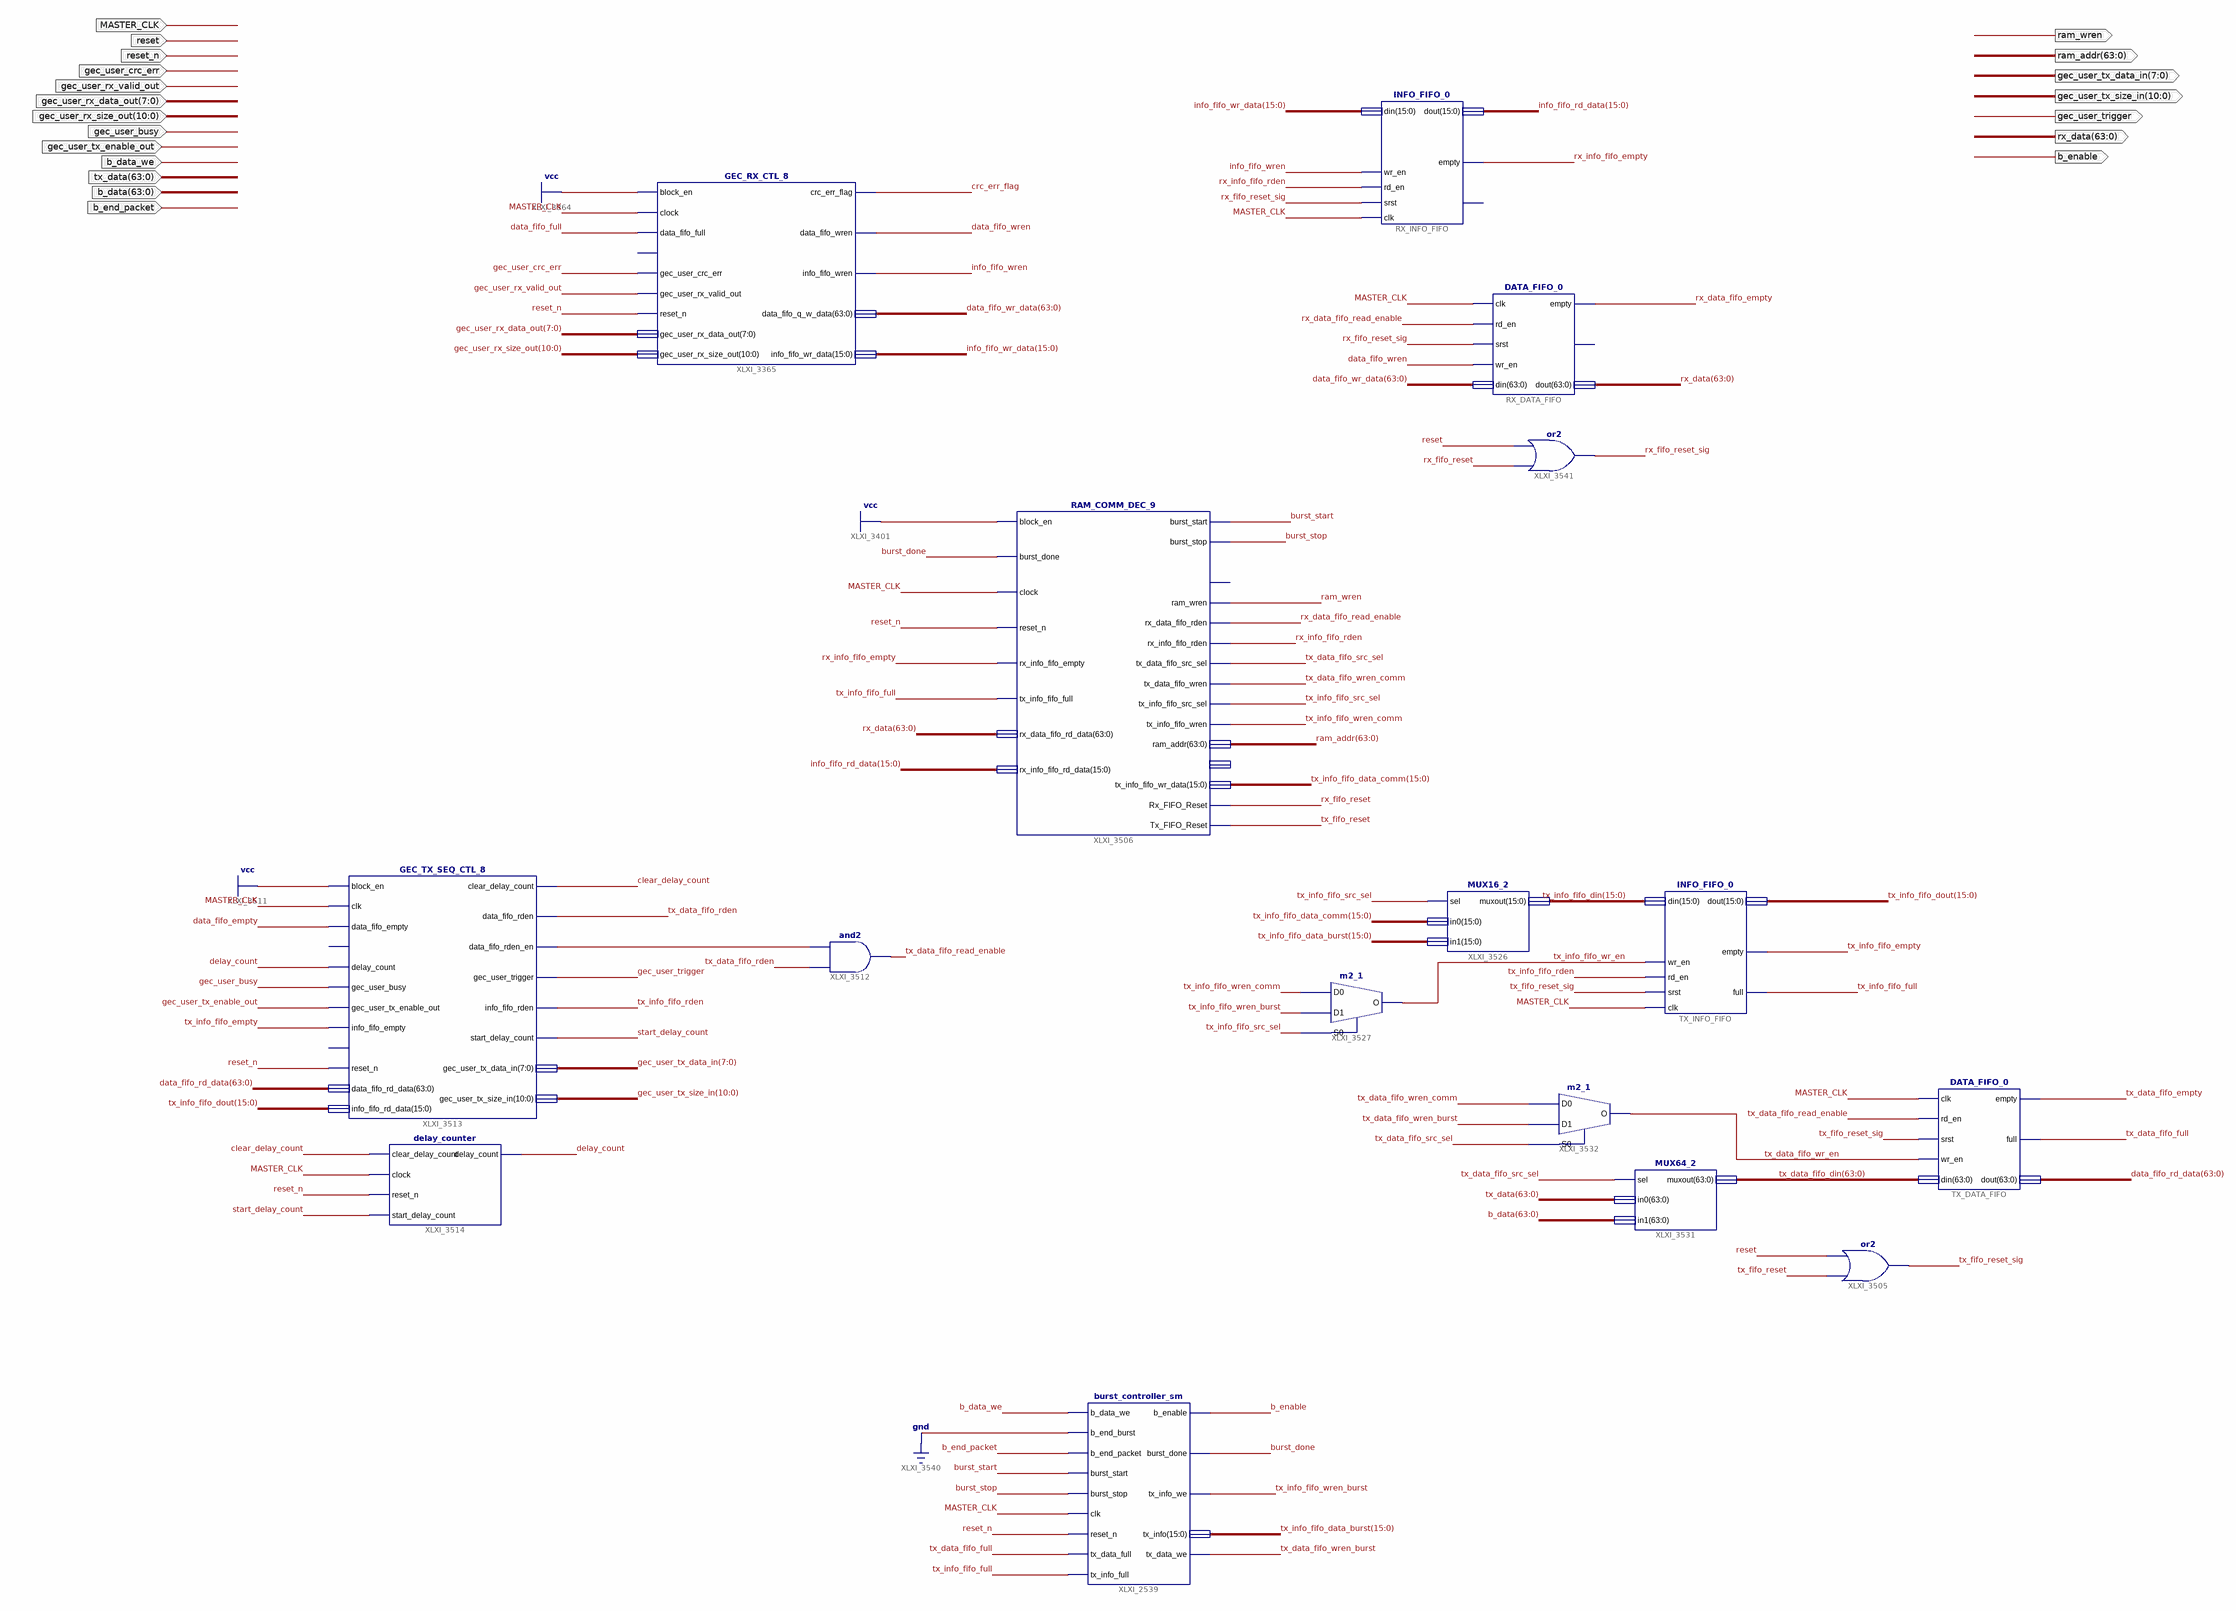
[diagram p0: schematic sheet 1]
// Xilinx ISE schematic DATA_MANAGER.sch (virtex4) as structural Verilog: 16 symbols, 20 ports
module DATA_MANAGER (
  input  reset,
  input  MASTER_CLK,
  input  reset_n,
  input  [10:0] gec_user_rx_size_out,
  input  gec_user_crc_err,
  input  gec_user_rx_valid_out,
  input  [7:0] gec_user_rx_data_out,
  input  gec_user_busy,
  input  gec_user_tx_enable_out,
  input  b_data_we,
  input  [63:0] tx_data,
  input  [63:0] b_data,
  input  b_end_packet,
  output [63:0] rx_data,
  output ram_wren,
  output [63:0] ram_addr,
  output [7:0] gec_user_tx_data_in,
  output [10:0] gec_user_tx_size_in,
  output gec_user_trigger,
  output b_enable
);

  wire burst_done, burst_start, burst_stop, clear_delay_count, crc_err_flag, data_fifo_empty, data_fifo_full,
       data_fifo_rden_en, data_fifo_wren, delay_count, info_fifo_wren, rx_data_fifo_empty,
       rx_data_fifo_read_enable, rx_fifo_reset, rx_fifo_reset_sig, rx_info_fifo_empty, rx_info_fifo_rden,
       start_delay_count, tx_data_fifo_empty, tx_data_fifo_full, tx_data_fifo_rden, tx_data_fifo_read_enable,
       tx_data_fifo_src_sel, tx_data_fifo_wr_en, tx_data_fifo_wren_burst, tx_data_fifo_wren_comm,
       tx_fifo_reset, tx_fifo_reset_sig, tx_info_fifo_empty, tx_info_fifo_full, tx_info_fifo_rden,
       tx_info_fifo_src_sel, tx_info_fifo_wr_en, tx_info_fifo_wren_burst, tx_info_fifo_wren_comm;
  wire [15:0] info_fifo_rd_data, info_fifo_wr_data, tx_info_fifo_data_burst, tx_info_fifo_data_comm,
       tx_info_fifo_din, tx_info_fifo_dout;
  wire [63:0] data_fifo_rd_data, data_fifo_wr_data, tx_data_fifo_din;

  GEC_TX_SEQ_CTL_8 XLXI_3513 (
    .block_en(1'b1), .clk(MASTER_CLK), .data_fifo_empty(data_fifo_empty), .delay_count(delay_count),
    .gec_user_busy(gec_user_busy), .gec_user_tx_enable_out(gec_user_tx_enable_out),
    .info_fifo_empty(tx_info_fifo_empty), .reset_n(reset_n), .data_fifo_rd_data(data_fifo_rd_data),
    .info_fifo_rd_data(tx_info_fifo_dout), .clear_delay_count(clear_delay_count),
    .data_fifo_rden(tx_data_fifo_rden), .data_fifo_rden_en(data_fifo_rden_en),
    .gec_user_trigger(gec_user_trigger), .info_fifo_rden(tx_info_fifo_rden),
    .start_delay_count(start_delay_count), .gec_user_tx_data_in(gec_user_tx_data_in),
    .gec_user_tx_size_in(gec_user_tx_size_in));  // open: data_fifo_rderr, info_fifo_rderr
  delay_counter XLXI_3514 (
    .clear_delay_count(clear_delay_count), .clock(MASTER_CLK), .reset_n(reset_n),
    .start_delay_count(start_delay_count), .delay_count(delay_count));
  and XLXI_3512 (tx_data_fifo_read_enable, tx_data_fifo_rden, data_fifo_rden_en);
  INFO_FIFO_0 TX_INFO_FIFO (
    .wr_en(tx_info_fifo_wr_en), .clk(MASTER_CLK), .srst(tx_fifo_reset_sig), .din(tx_info_fifo_din),
    .rd_en(tx_info_fifo_rden), .dout(tx_info_fifo_dout), .empty(tx_info_fifo_empty), .full(tx_info_fifo_full));
  MUX16_2 XLXI_3526 (
    .sel(tx_info_fifo_src_sel), .in0(tx_info_fifo_data_comm), .in1(tx_info_fifo_data_burst),
    .muxout(tx_info_fifo_din));
  m2_1 XLXI_3527 (
    .D0(tx_info_fifo_wren_comm), .D1(tx_info_fifo_wren_burst), .S0(tx_info_fifo_src_sel),
    .O(tx_info_fifo_wr_en));
  MUX64_2 XLXI_3531 (.sel(tx_data_fifo_src_sel), .in0(tx_data), .in1(b_data), .muxout(tx_data_fifo_din));
  m2_1 XLXI_3532 (
    .D0(tx_data_fifo_wren_comm), .D1(tx_data_fifo_wren_burst), .S0(tx_data_fifo_src_sel),
    .O(tx_data_fifo_wr_en));
  DATA_FIFO_0 TX_DATA_FIFO (
    .clk(MASTER_CLK), .rd_en(tx_data_fifo_read_enable), .srst(tx_fifo_reset_sig), .wr_en(tx_data_fifo_wr_en),
    .din(tx_data_fifo_din), .empty(tx_data_fifo_empty), .full(tx_data_fifo_full), .dout(data_fifo_rd_data));
  GEC_RX_CTL_8 XLXI_3365 (
    .block_en(1'b1), .clock(MASTER_CLK), .data_fifo_full(data_fifo_full),
    .gec_user_crc_err(gec_user_crc_err), .gec_user_rx_valid_out(gec_user_rx_valid_out), .reset_n(reset_n),
    .gec_user_rx_data_out(gec_user_rx_data_out), .gec_user_rx_size_out(gec_user_rx_size_out),
    .crc_err_flag(crc_err_flag), .data_fifo_wren(data_fifo_wren), .info_fifo_wren(info_fifo_wren),
    .data_fifo_q_w_data(data_fifo_wr_data), .info_fifo_wr_data(info_fifo_wr_data));  // open: data_fifo_wrerr
  INFO_FIFO_0 RX_INFO_FIFO (
    .wr_en(info_fifo_wren), .clk(MASTER_CLK), .srst(rx_fifo_reset_sig), .din(info_fifo_wr_data),
    .rd_en(rx_info_fifo_rden), .dout(info_fifo_rd_data), .empty(rx_info_fifo_empty));  // open: full
  DATA_FIFO_0 RX_DATA_FIFO (
    .clk(MASTER_CLK), .rd_en(rx_data_fifo_read_enable), .srst(rx_fifo_reset_sig), .wr_en(data_fifo_wren),
    .din(data_fifo_wr_data), .empty(rx_data_fifo_empty), .dout(rx_data));  // open: full
  RAM_COMM_DEC_9 XLXI_3506 (
    .block_en(1'b1), .burst_done(burst_done), .clock(MASTER_CLK), .reset_n(reset_n),
    .rx_info_fifo_empty(rx_info_fifo_empty), .tx_info_fifo_full(tx_info_fifo_full),
    .rx_data_fifo_rd_data(rx_data), .rx_info_fifo_rd_data(info_fifo_rd_data), .burst_start(burst_start),
    .burst_stop(burst_stop), .ram_wren(ram_wren), .rx_data_fifo_rden(rx_data_fifo_read_enable),
    .Rx_FIFO_Reset(rx_fifo_reset), .rx_info_fifo_rden(rx_info_fifo_rden),
    .tx_data_fifo_src_sel(tx_data_fifo_src_sel), .tx_data_fifo_wren(tx_data_fifo_wren_comm),
    .Tx_FIFO_Reset(tx_fifo_reset), .tx_info_fifo_src_sel(tx_info_fifo_src_sel),
    .tx_info_fifo_wren(tx_info_fifo_wren_comm), .ram_addr(ram_addr),
    .tx_info_fifo_wr_data(tx_info_fifo_data_comm));  // open: ram_en, state_diag
  burst_controller_sm XLXI_2539 (
    .b_data_we(b_data_we), .b_end_burst(1'b0), .b_end_packet(b_end_packet), .burst_start(burst_start),
    .burst_stop(burst_stop), .clk(MASTER_CLK), .reset_n(reset_n), .tx_data_full(tx_data_fifo_full),
    .tx_info_full(tx_info_fifo_full), .b_enable(b_enable), .burst_done(burst_done),
    .tx_data_we(tx_data_fifo_wren_burst), .tx_info_we(tx_info_fifo_wren_burst),
    .tx_info(tx_info_fifo_data_burst));
  or XLXI_3541 (rx_fifo_reset_sig, rx_fifo_reset, reset);
  or XLXI_3505 (tx_fifo_reset_sig, tx_fifo_reset, reset);
endmodule
